# EAGLE design air-quality (EAGLE 9.5.2)
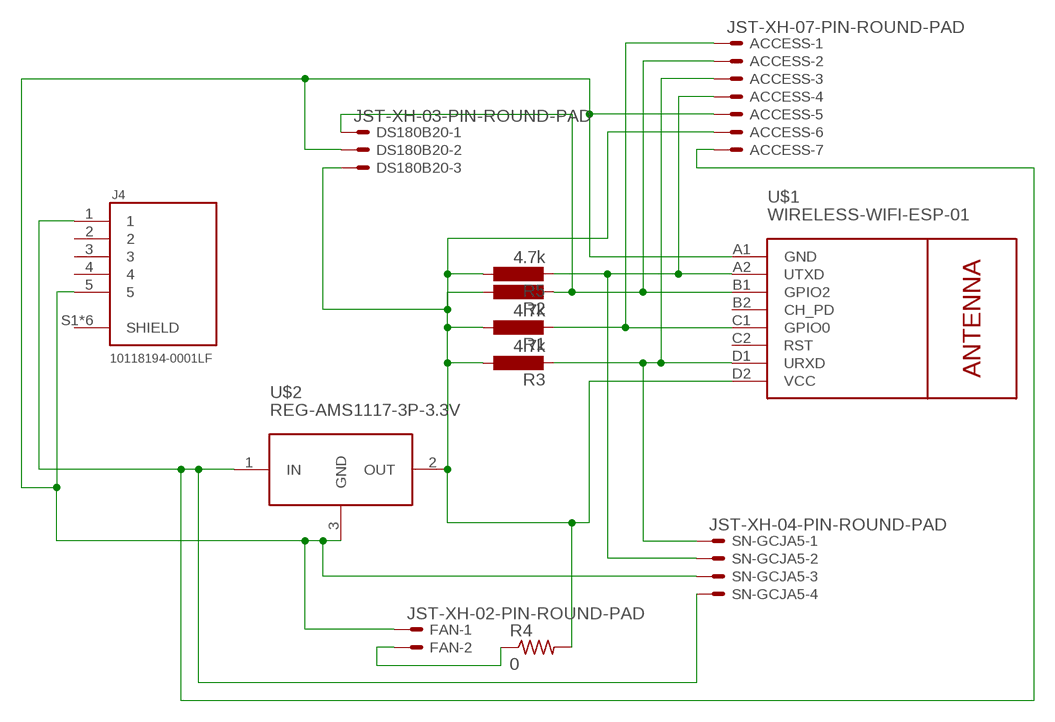
[diagram p0: schematic, sheet 1]

## Parts
ACCESS  JST-XH-07-PIN-ROUND-PAD  [JST-XH-07-PACKAGE-ROUND-PAD]
DS180B20  JST-XH-03-PIN-ROUND-PAD  [JST-XH-03-PACKAGE-ROUND-PAD]
FAN  JST-XH-02-PIN-ROUND-PAD  [JST-XH-02-PACKAGE-ROUND-PAD]
J4  10118194-0001LF  [AMPHENOL_10118194-0001LF]
R1  4.7k  L-EU0207/10  [0207/10]
R2  4.7k  L-EU0207/10  [0207/10]
R3  4.7k  L-EU0207/10  [0207/10]
R4  0  R-US_0204/2V  [0204V]
R5  4.7k  L-EU0207/10  [0207/10]
SN-GCJA5  JST-XH-04-PIN-ROUND-PAD  [JST-XH-04-PACKAGE-ROUND-PAD]
U$1  WIRELESS-WIFI-ESP-01  [WIRELESS-WIFI-ESP-01]
U$2  REG-AMS1117-3P-3.3V  [REG-AMS1117-3P]

## Nets
3.3V: ACCESS.6 DS180B20.3 R1.1 R2.1 R3.1 R4.2 R5.1 U$1.D2(VCC) U$2.2(OUT)
5V: ACCESS.7 J4.1 SN-GCJA5.4 U$2.1(IN)
GND: ACCESS.5 DS180B20.2 FAN.1 J4.5 SN-GCJA5.3 U$1.A1(GND) U$2.3(GND)
GPIO0: ACCESS.1 R1.2 U$1.C1(GPIO0)
GPIO2: ACCESS.2 DS180B20.1 R2.2 U$1.B1(GPIO2)
N$2: FAN.2 R4.1
RX: ACCESS.3 R3.2 SN-GCJA5.1 U$1.D1(URXD)
TX: ACCESS.4 R5.2 SN-GCJA5.2 U$1.A2(UTXD)
Unconnected: J4.2 J4.3 J4.4 J4.S1(SHIELD) J4.S2(SHIELD) J4.S3(SHIELD) J4.S4(SHIELD) J4.S5(SHIELD) J4.S6(SHIELD) U$1.B2(CH_PD) U$1.C2(RST)

## Library data of the parts
ACCESS = Rembrandt Electronics - JST XH Connectors v1-0:JST-XH-07-PIN: JST XH Connector 2 Pin Wire to board connector. Pitch: 2,54 mm, (0.100") Number of pins: 7 Created by Rembrandt Electronics www.rembrandtelectronics.com
DS180B20 = Rembrandt Electronics - JST XH Connectors v1-0:JST-XH-03-PIN: JST XH Connector 2 Pin Wire to board connector. Pitch: 2,54 mm, (0.100") Number of pins: 3 Created by Rembrandt Electronics www.rembrandtelectronics.com
FAN = Rembrandt Electronics - JST XH Connectors v1-0:JST-XH-02-PIN: JST XH Connector 2 Pin Wire to board connector. Pitch: 2,54 mm, (0.100") Number of pins: 2 Created by Rembrandt Electronics www.rembrandtelectronics.com
J4 = 10118194-0001LF.3:10118194-0001LF: Micro Usb, 2.0 Type b, Rcpt, Smt; DESCRIPTION: USB - micro B USB 2.0 Receptacle Connector 5 Position Surface Mount, Right Angle; Through Hole; DIGI-KEY_PART_NUMBER: 609-4618-1-ND; DIGI-KEY_PURCHASE_URL: https://www.digikey.com/product-detail/en/amphenol-icc-fci/10118194-0001LF/609-4618-1-ND/2785382?utm_source=snapeda&utm_medium=aggregator&utm_campaign=symbol; MF: Amphenol ICC; MP: 10118194-0001LF; PACKAGE: None
R1-R3 R5 = resistor:L-EU: INDUCTOR, European symbol
R4 = adafruit:R-US_: RESISTOR, American symbol
SN-GCJA5 = Rembrandt Electronics - JST XH Connectors v1-0:JST-XH-04-PIN: JST XH Connector 2 Pin Wire to board connector. Pitch: 2,54 mm, (0.100") Number of pins: 4 Created by Rembrandt Electronics www.rembrandtelectronics.com
U$1 = diy-modules:WIRELESS-WIFI-ESP-01: Wireless Wi-Fi ESP-01 Module based on ESP8266 chip Click here to find device on ebay.com <http://www.ebay.com/sch/esp8266+esp+01+transceiver>
U$2 = diy-modules:REG-AMS1117-3P-*: Linear Regulator based on AMS1117 chip 3-pin version AMS1117 datasheet is available here: http://www.advanced-monolithic.com/pdf/ds1117.pdf Click here to find device on ebay.com <http://www.ebay.com/sch/ams1117+module> Note: There are many variants. Search for the proper version.

## Net classes
0 default: clearance 0.205 mm

## Board
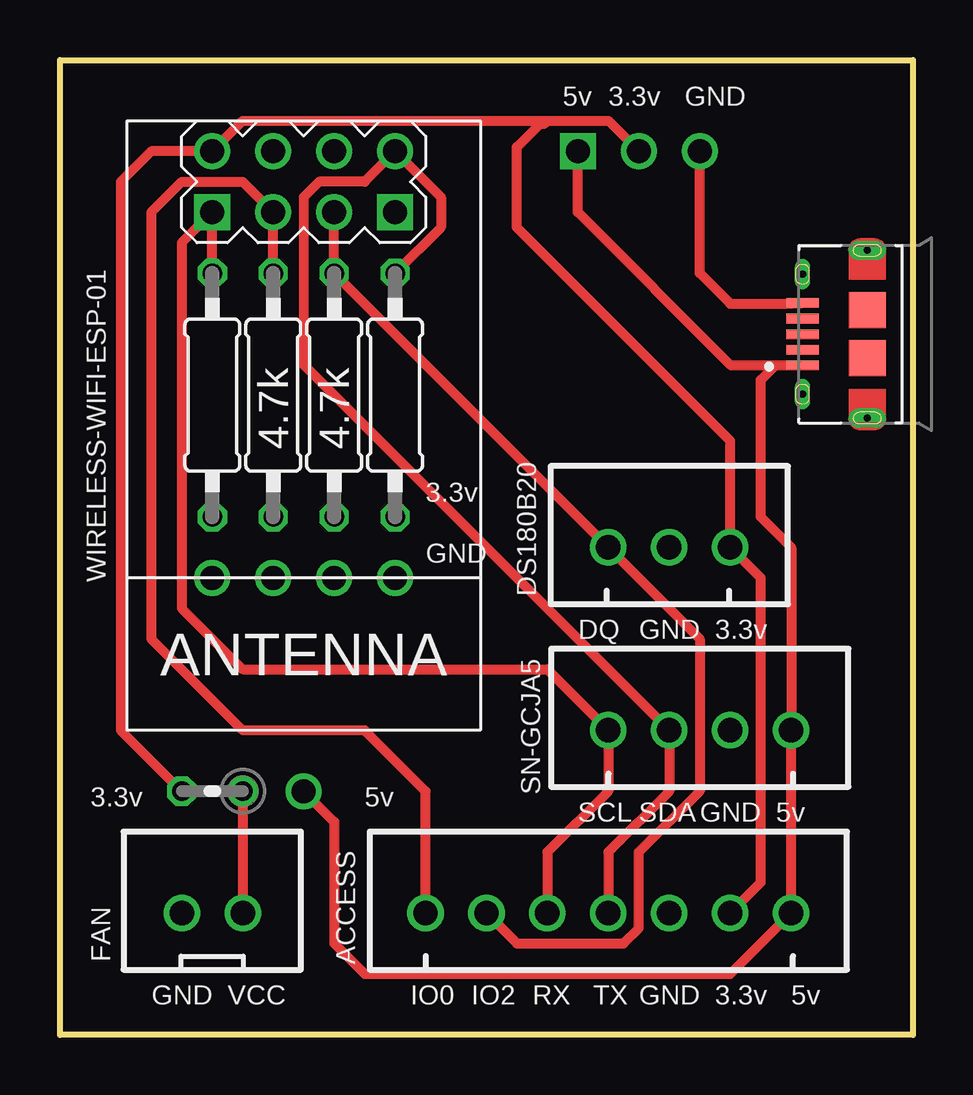
[diagram p1: board, top side]
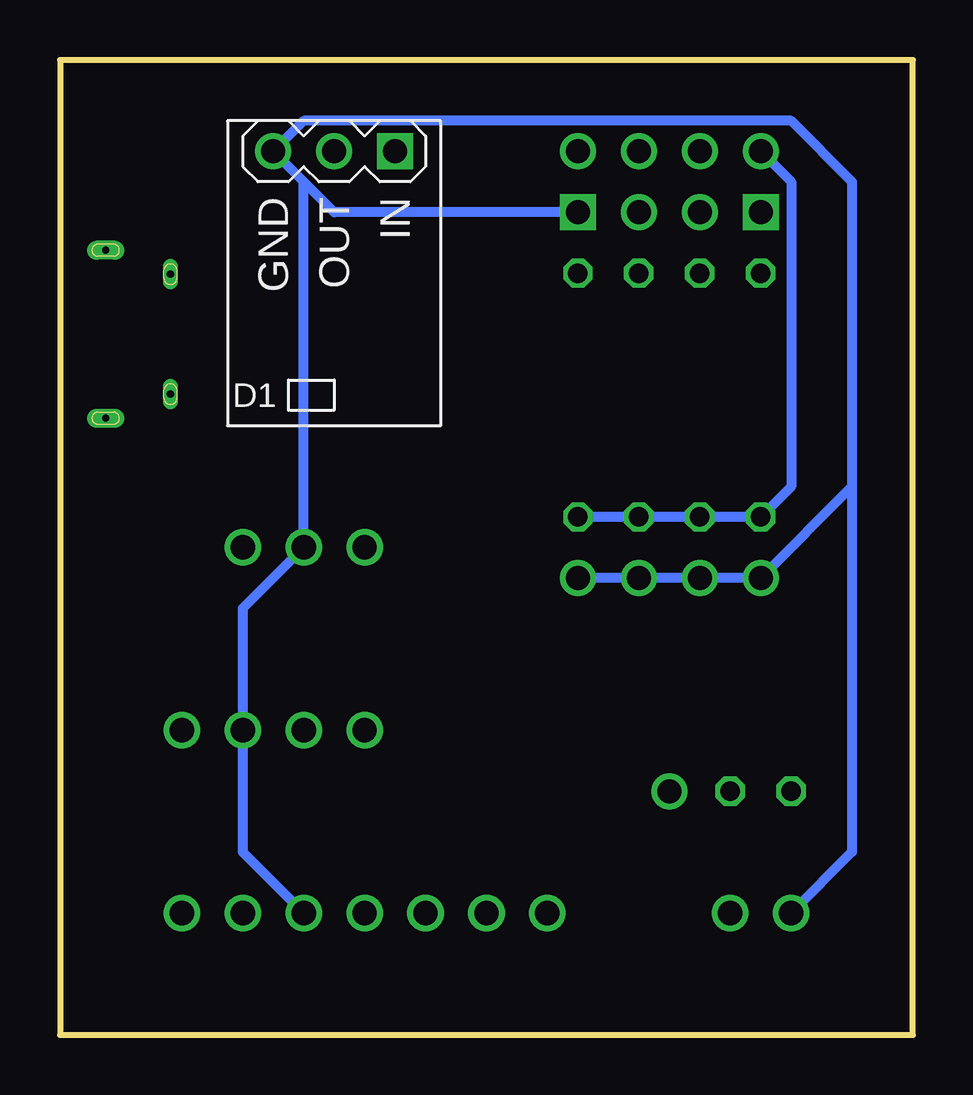
[diagram p2: board, bottom side, seen from below]

Size 35.56 x 40.64 mm. Coordinates in mm from the lower left corner, seen from the top.
Outline: 0,0 0,40.64 35.56,40.64 35.56,0 0,0
Copper layers (1*16): Top 0.035559375mm / dielectric 1.6mm / Bottom 0.035559375mm
Design rules "oshpark-2layer": minimum track width 6mil, minimum drill 10mil, track to track 6mil, track to pad 6mil, pad to pad 6mil, via to via 6mil, smd to smd 6mil, copper to edge 15mil, drill to drill 6mil, minimum pad ring 5mil, minimum via ring 5mil, stop-mask expansion 2.5mil, vias tented up to drill 0mil, thermal gap 10mil

### Footprints (pad centres in the part's own frame; a part is rotated, then mirrored left to right if it is on the bottom)
JST-XH-07-PACKAGE-ROUND-PAD = drill 1.016: 1 -7.62,0; 2 -5.08,0; 3 -2.54,0; 4 0,0; 5 2.54,0; 6 5.08,0; 7 7.62,0
JST-XH-03-PACKAGE-ROUND-PAD = drill 1.016: 1 -2.54,0; 2 0,0; 3 2.54,0
JST-XH-02-PACKAGE-ROUND-PAD = drill 1.016: 1 -1.27,0; 2 1.27,0
AMPHENOL_10118194-0001LF = smd 0.4 x 1.35: 1 -1.3,2.7; 2 -0.65,2.7; 3 0,2.7; 4 0.65,2.7; 5 1.3,2.7 | drill 0.305 pad 0.635 long: S1 -2.5,2.7; S2 2.5,2.7 | drill 0.305 pad 0.787 long: S3 -3.5,0; S6 3.5,0 | smd 1.5 x 1.55: S4 -1,0; S5 1,0
0207/10 = drill 0.813 octagon: 1 -5.08,0; 2 5.08,0
0204V = drill 0.813 octagon: 1 -1.27,0; 2 1.27,0
JST-XH-04-PACKAGE-ROUND-PAD = drill 1.016: 1 -3.81,0; 2 -1.27,0; 3 1.27,0; 4 3.81,0
WIRELESS-WIFI-ESP-01 = drill 1 square: A1 -8.89,3.81; D1 -8.89,-3.81 | drill 1: A2 -11.43,3.81; B1 -8.89,1.27; B2 -11.43,1.27; C1 -8.89,-1.27; C2 -11.43,-1.27; D2 -11.43,-3.81
REG-AMS1117-3P = drill 1 square: 1 -2.54,-5.08 | drill 1: 2 0,-5.08; 3 2.54,-5.08

### Placement (x,y rotation side)
ACCESS  22.86,5.08 0 top
DS180B20  25.4,20.32 0 top
FAN  6.35,5.08 0 top
J4  33.66,29.21 90 top
R1  8.89,26.67 90 top
R2  11.43,26.67 90 top
R3  6.35,26.67 90 top
R4  6.35,10.16 180 top
R5  13.97,26.67 90 top
SN-GCJA5  26.67,12.7 0 top
U$1  10.16,25.4 270 top
U$2  24.13,31.75 180 bottom

### Tracks (layer width: path | path; a pad name or v marks a point on that pad's centre or on a via)
3.3V
  Top 0.406: ACCESS.6 29.21,6.35 29.21,19.05 DS180B20.3 27.94,24.77 19.05,33.66 19.05,37.01 20.03,37.99 20.21,37.99 20.32,38.1 | 20.32,38.1 7.62,38.1 U$1.D2 3.81,36.83 2.54,35.56 2.54,12.7 R4.2 | 20.32,38.1 22.86,38.1 U$2.2
  Bottom 0.406: U$1.D2 5.08,35.56 5.08,22.86 R3.1 R1.1 R2.1 R5.1
5V  (via drill 1 pad 1.3)
  Top 0.406: U$2.1 21.59,34.29 27.97,27.91 29.81,27.91 | v10.16,10.16 11.43,8.89 11.43,3.81 12.7,2.54 27.94,2.54 ACCESS.7 SN-GCJA5.4 30.48,20.32 29.21,21.59 29.21,27.3 29.81,27.91 | J4.1 29.81,27.91
GND  (via drill 1 pad 1.3)
  Top 0.406: J4.5 30.51,30.51 30.48,30.48 27.94,30.48 26.67,31.75 U$2.3
  Bottom 0.406: U$1.A1 24.13,34.29 25.4,35.56 | 25.4,35.56 U$2.3 25.4,38.1 5.08,38.1 2.54,35.56 2.54,22.86 | 2.54,22.86 2.54,7.62 FAN.1 | ACCESS.5 27.94,7.62 SN-GCJA5.3 27.94,17.78 DS180B20.2 25.4,35.56 | 2.54,22.86 v6.35,19.05 v8.89,19.05 v11.43,19.05 v13.97,19.05
GPIO0
  Top 0.406: ACCESS.1 15.24,10.16 12.7,12.7 7.62,12.7 3.81,16.51 3.81,34.29 5.08,35.56 7.62,35.56 U$1.C1 R1.2
GPIO2
  Top 0.406: U$1.B1 R2.2 DS180B20.1 26.67,16.51 26.67,10.16 24.13,7.62 24.13,4.45 23.49,3.81 19.05,3.81 ACCESS.2
N$2
  Top 0.406: R4.1 FAN.2
RX
  Top 0.406: ACCESS.3 20.32,7.62 22.86,10.16 SN-GCJA5.1 20.32,15.24 7.62,15.24 5.08,17.78 5.08,33.02 U$1.D1 R3.2
TX
  Top 0.406: ACCESS.4 22.86,7.62 25.4,10.16 SN-GCJA5.2 10.16,27.94 10.16,34.92 10.79,35.56 12.7,35.56 U$1.A2 15.88,34.92 15.88,33.66 R5.2

### Text on the board
tNames: 5v | 3.3v | GND | 3.3v | GND | DQ | GND | 3.3v | 3.3v | 5v | SCL | SDA | GND | 5v | GND | VCC | IO0 | IO2 | RX | TX | GND | 3.3v | 5v